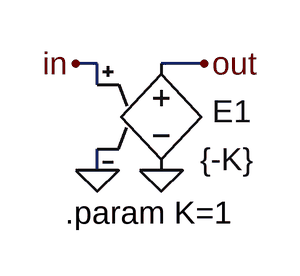
[diagram p0: schematic AmpInv.asc]
AmpInv.asc, the LTspice schematic file:
Version 4
SHEET 1 880 680
WIRE 160 112 144 112
WIRE 240 112 208 112
WIRE 160 128 160 112
WIRE 160 192 160 176
FLAG 208 192 0
FLAG 160 192 0
FLAG 144 112 in
FLAG 240 112 out
SYMBOL e 208 96 R0
WINDOW 0 38 52 Left 0
WINDOW 3 29 88 Left 0
SYMATTR InstName E1
SYMATTR Value {-K}
TEXT 136 224 Left 0 !.param K=1

The netlist it stands for:
* AmpInv.asc
E1 out 0 in 0 {-K}
.param K=1
.backanno
.end